# Altium schematic sheet memory.SchDoc
size A3; DocumentNumber: 31; SheetNumber: 31; SheetTotal: 45; SheetDescription: FRAM, MRAM and Flash Memory
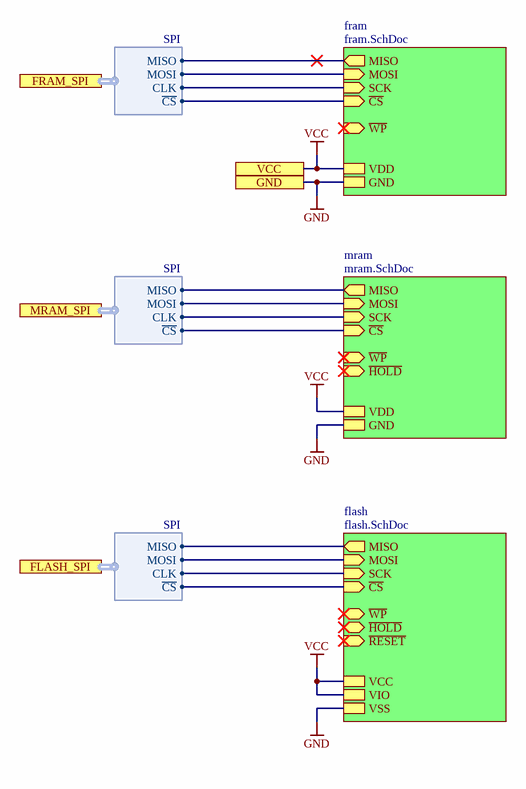
[diagram p0: memory.SchDoc]

## Sub-sheets
flash = flash.SchDoc: MISO (out), ~{CS} (in), MOSI (in), SCK (in), ~{RESET} (in), ~{HOLD} (bidir), VCC, ~{WP} (bidir), VSS, VIO
fram = fram.SchDoc: MISO (out), ~{CS} (in), MOSI (in), SCK (in), GND, ~{WP} (in), VDD
mram = mram.SchDoc: MISO (out), ~{CS} (in), MOSI (in), SCK (in), GND, ~{WP} (in), VDD, ~{HOLD} (in)

## Ports
FLASH_SPI (harness SPI), FRAM_SPI (harness SPI), GND, MRAM_SPI (harness SPI), VCC

## Harnesses
SPI: CLK, MOSI, MISO, ~{CS}

## Nets
GND: port GND, sheet fram/GND, sheet mram/GND, sheet flash/VSS
VCC: port VCC, sheet fram/VDD, sheet mram/VDD, sheet flash/VCC, sheet flash/VIO
(unnamed): sheet fram/MISO, port FRAM_SPI.MISO
(unnamed): sheet fram/~{CS}, port FRAM_SPI.~{CS}
(unnamed): sheet fram/MOSI, port FRAM_SPI.MOSI
(unnamed): sheet fram/SCK, port FRAM_SPI.CLK
(unnamed): sheet mram/MISO, port MRAM_SPI.MISO
(unnamed): sheet mram/~{CS}, port MRAM_SPI.~{CS}
(unnamed): sheet mram/MOSI, port MRAM_SPI.MOSI
(unnamed): sheet mram/SCK, port MRAM_SPI.CLK
(unnamed): sheet flash/MISO, port FLASH_SPI.MISO
(unnamed): sheet flash/~{CS}, port FLASH_SPI.~{CS}
(unnamed): sheet flash/MOSI, port FLASH_SPI.MOSI
(unnamed): sheet flash/SCK, port FLASH_SPI.CLK

## Notes on the sheet
- Fraunhofer IISB
- Schottkystr. 10
- developed by:
- 91058 Erlangen
- Germany
- Author
- Project
- License
- Description
- File
- Version
- Release Date
- Sheet
- foxbms.org <https://foxbms.org>
- www.iisb.fraunhofer.de <https://www.iisb.fraunhofer.de/>
- foxBMS Team
- /